# EAGLE design NeatoLDS Breakout Board_v0.1 (EAGLE 6.5.0)
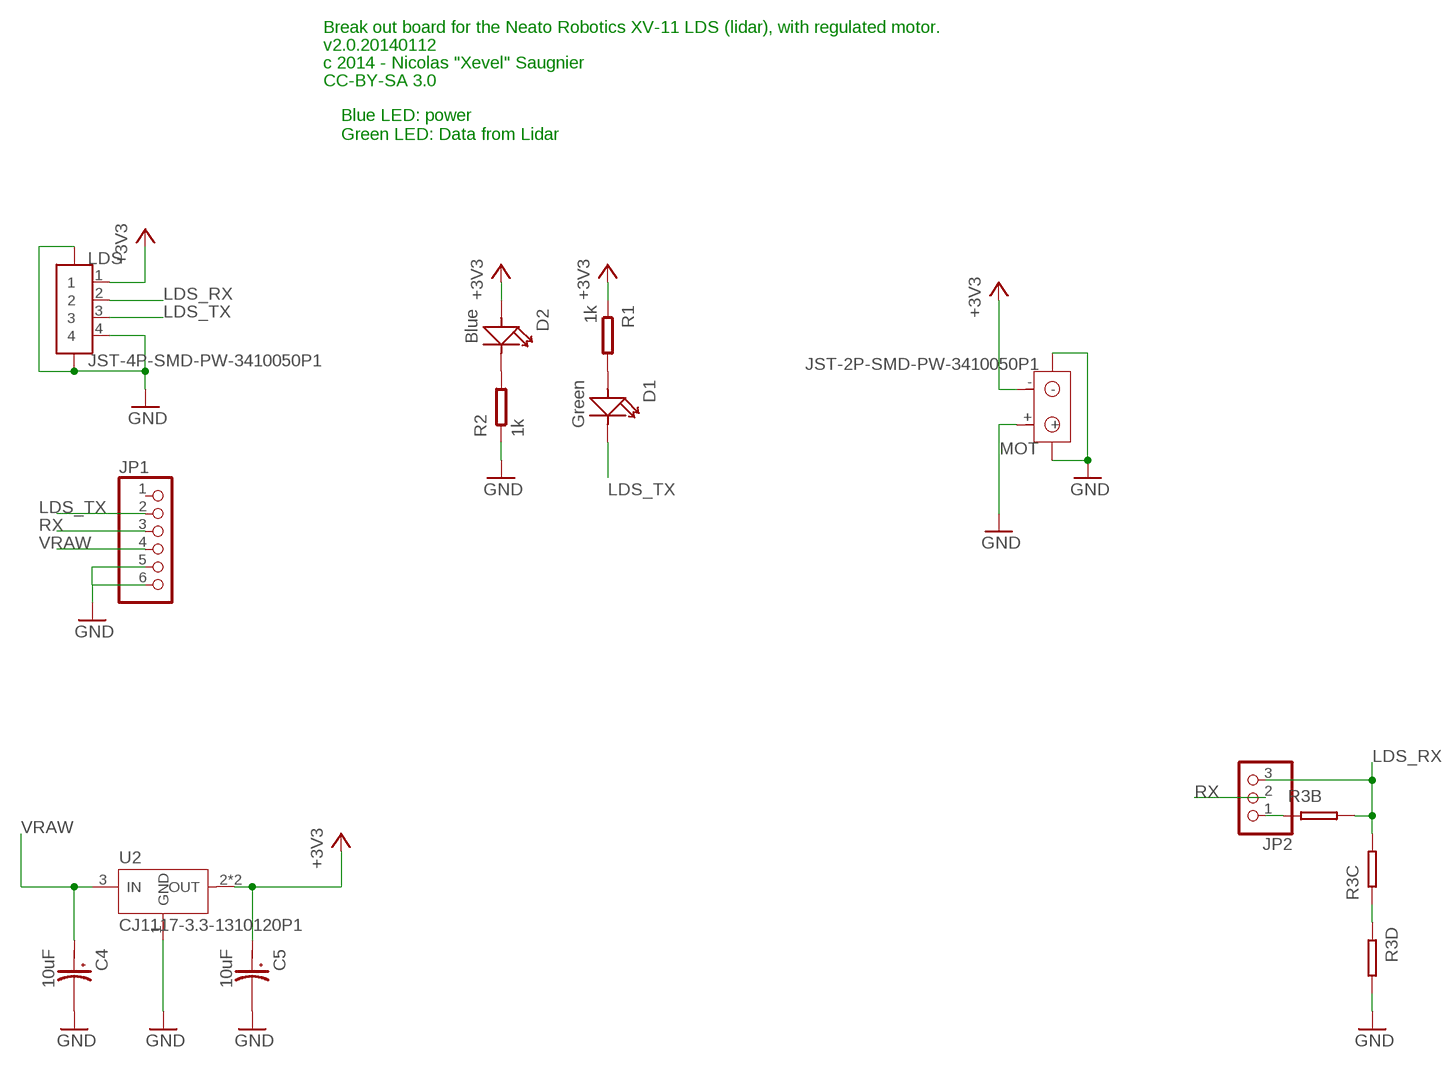
[diagram p0: schematic, sheet 1]

## Parts
C4  10uF  C-POLAR-A  [AVX-A]
C5  10uF  C-POLAR-A  [AVX-A]
D1  Green  LED  [LED0603]
D2  Blue  LED  [LED0603]
JP1  PINHD-1X6  [1X06]
JP2  PINHD-1X3  [1X03]
LDS  JST-4P-SMD-PW-3410050P1  [CON-4P-SMD-2.0-90D]
MOT  JST-2P-SMD-PW-3410050P1  [2P-SMD-2.0-90D]
R1  1k  R-0603  [R0603]
R2  1k  R-0603  [R0603]
R3  R-4R  [R1206-8]
U2  CJ1117-3.3-1310120P1  [SOT89]

## Nets
+3V3: C5.+ D2.+ LDS.1 MOT.- R1.1 U2.2(OUT) U2.4(OUT)
GND: C4.- C5.- JP1.5 JP1.6 LDS.4 LDS.5 LDS.6 MOT.3 MOT.4 MOT.+ R2.1 R3.5 U2.1(GND)
LDS_RX: JP2.3 LDS.2 R3.6 R3.7
LDS_TX: D1.- JP1.2 LDS.3
N$1: R3.3 R3.4
N$2: JP2.1 R3.2
N$5: D1.+ R1.2
N$7: D2.- R2.2
RX: JP1.3 JP2.2
VRAW: C4.+ JP1.4 U2.3(IN)
Unconnected: JP1.1 R3.1 R3.8

## Notes on the sheet
- Break out board for the Neato Robotics XV-11 LDS (lidar), with regulated motor.
- v2.0.20140112
- c 2014 - Nicolas "Xevel" Saugnier
- CC-BY-SA 3.0
- Blue LED: power
  Green LED: Data from Lidar

## Library data of the parts
C4 C5 = OPL:C-POLAR*
D1 D2 = OPL:LED*: LED
JP1 = pinhead:PINHD-1X6: PIN HEADER
JP2 = pinhead:PINHD-1X3: PIN HEADER
LDS = Xevelabs:JST-4P-SMD-PW
MOT = OPL:JST-2P-SMD-PW
R1 R2 = OPL:R*
R3 = OPL:R-4R*: Resistor Array
U2 = OPL:CJ1117-3.3: 1A Low Dropout Linear Regulator

## Board
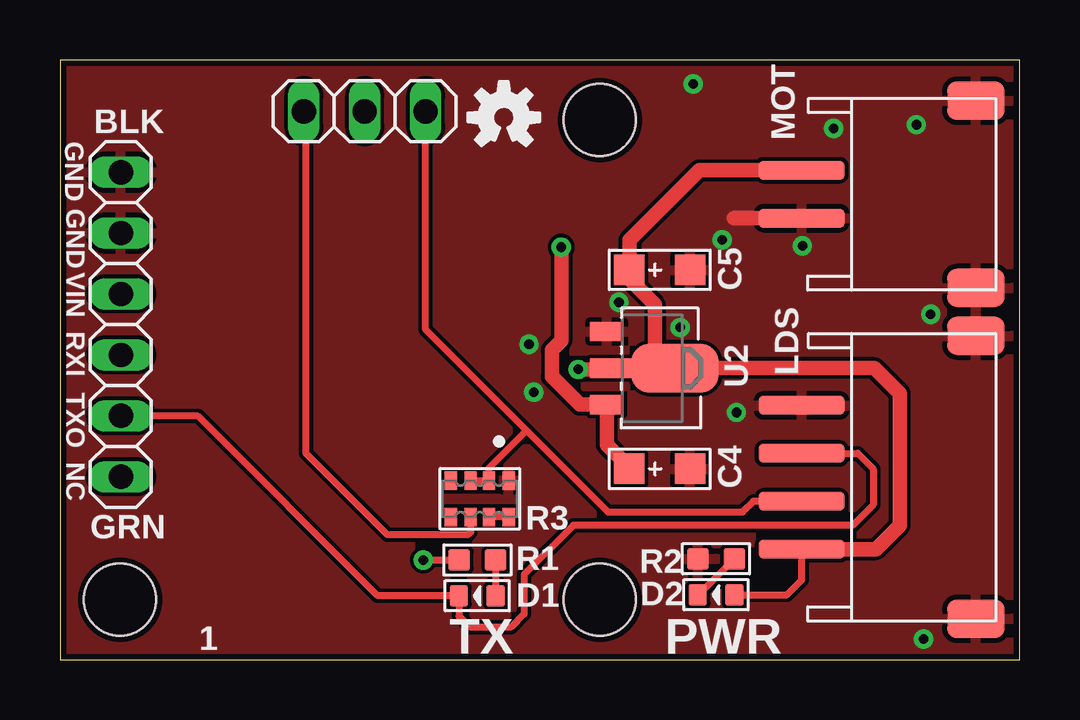
[diagram p1: board, top side]
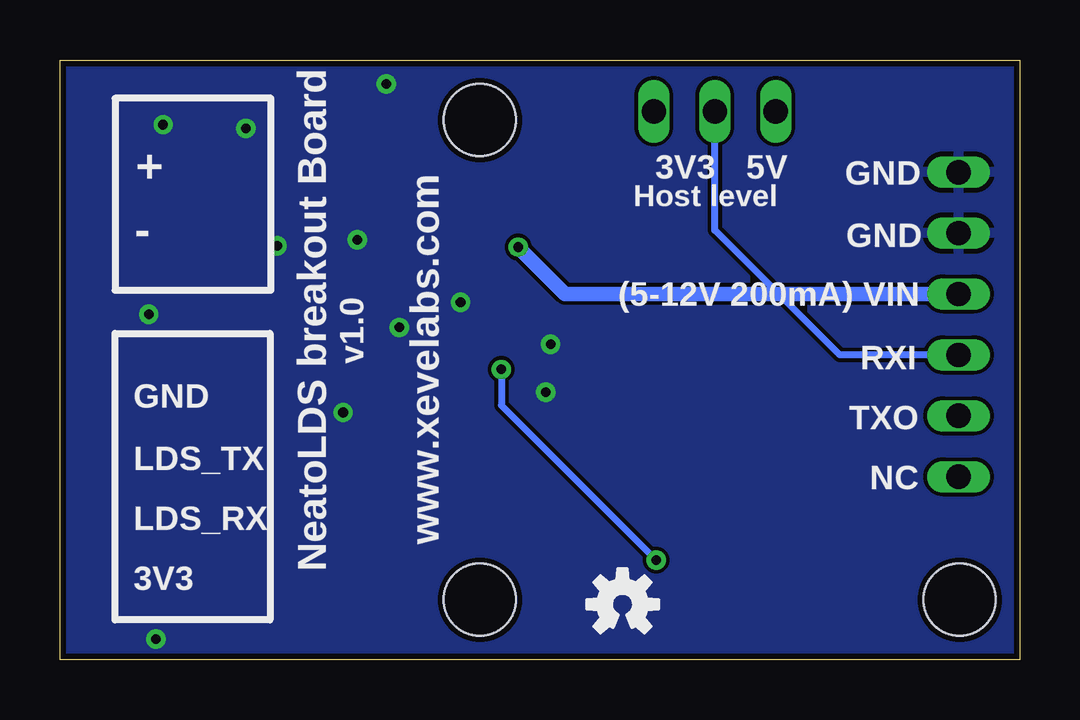
[diagram p2: board, bottom side, seen from below]

Size 40 x 25 mm. Coordinates in mm from the lower left corner, seen from the top.
Outline: 0,0 40,0 40,25 0,25 0,0
Copper layers (1*16): Top 0.035mm / dielectric 1.55mm / Bottom 0.035mm
Design rules "Xevelabs_6mil_eurocircuits": minimum track width 0.15mm, minimum drill 0.25mm, track to track 0.155mm, track to pad 0.155mm, pad to pad 0.155mm, via to via 0.155mm, smd to smd 0mil, copper to edge 0.25mm, drill to drill 0.25mm, minimum pad ring 0mil, minimum via ring 0.2mm, stop-mask expansion 0mil, vias tented up to drill 100mil, thermal gap 0.2mm
Holes 3 mm at 2.5,2.5 22.5,22.5 22.5,2.5

### Footprints (pad centres in the part's own frame; a part is rotated, then mirrored left to right if it is on the bottom)
AVX-A = smd 1.27 x 1.27: + -1.27,0; - 1.27,0
LED0603 = smd 0.762 x 0.889: + -0.762,0; - 0.762,0
1X06 = drill 1.016 long: 1 -6.35,0; 2 -3.81,0; 3 -1.27,0; 4 1.27,0; 5 3.81,0; 6 6.35,0
1X03 = drill 1.016 long: 1 -2.54,0; 2 0,0; 3 2.54,0
CON-4P-SMD-2.0-90D = smd 0.8 x 3.6: 1 -3,5.08; 2 -1,5.08; 3 1,5.08; 4 3,5.08 | smd 1.6 x 2.4: 5 -5.9,-2.181; 6 5.9,-2.181
2P-SMD-2.0-90D = smd 1.6 x 2.4: 3 3.9,-2.181; 4 -3.9,-2.181 | smd 0.8 x 3.6: + -1,5.08; - 1,5.08
R0603 = smd 0.889 x 0.889: 1 -0.762,0; 2 0.762,0
R1206-8 = smd 0.508 x 0.762: 1 -1.206,-0.762; 2 -0.381,-0.762; 3 0.381,-0.762; 4 1.206,-0.762; 5 1.206,0.762; 6 0.381,0.762; 7 -0.381,0.762; 8 -1.206,0.762
SOT89 = smd 0.8 x 1.4: 1 -1.524,-1.905; 3 1.524,-1.905 | smd 0.8 x 1.9: 2 0,-1.651 | smd 2.032 x 3.65: 4 0,0.94

### Placement (x,y rotation side)
C4  25,7.95 0 top
C5  25,16.25 0 top
D1  17.39,2.66 180 top
D2  27.35,2.7 180 top
JP1  2.54,13.97 90 top
JP2  12.7,22.86 0 top
LDS  36,7.6 90 top
MOT  36,19.4 90 top
R1  17.4,4.15 0 top
R2  27.35,4.2 0 top
R3  17.5,6.7 0 top
U2  24.7,12.15 270 top
U$1  [OSHW-LOGO-S]  18.5,22.6 0 top
U$2  [OSHW-LOGO-S]  16.55,2.3 0 bottom

### Tracks (layer width: path | path; a pad name or v marks a point on that pad's centre or on a via)
+3V3  (via drill 0.4)
  Top 0.3: D2.+ 30.3,2.7 30.92,3.32 LDS.1 | v15.15,4.15 R1.1
  Top 0.6: 24.8,12.15 U2.2 23,12.1 v21.6,12.1 | 24.8,12.15 U2.4 33.95,12.15 35,11.1 35,5.6 34,4.6 LDS.1 | 24.8,12.15 24.8,14.8 23.73,15.87 C5.+ 23.73,17.48 26.65,20.4 MOT.-
  Bottom 0.3: v21.6,12.1 21.6,10.6 v15.15,4.15
GND  (via drill 0.4)
  Top 0.6: 28.1,18.4 MOT.+
  other vias: 28.2,10.3 30.95,17.25 36.3,14.4 35.7,22.3 23.3,14.9 32.25,22.15 27.6,17.5 36,0.85 26.4,24 25.85,13.85 19.55,13.15 19.75,11.15
  pour Bottom: -0.6,25.7 42.5,25.85 43.1,-1.8 -0.7,-0.8 -0.7,25.7
  pour Top: -1.3,25.9 43.6,27.45 42.4,-1.35 -1.3,-0.6
LDS_RX
  Top 0.3: LDS.2 28.9,6.6 28.45,6.15 22.85,6.15 19.45,9.55 | R3.7 R3.6 17.88,7.98 19.45,9.55 | 19.45,9.55 15.24,13.76 JP2.3
LDS_TX
  Top 0.3: LDS.3 33.25,8.6 33.9,7.95 33.9,6.45 33.05,5.6 21.4,5.6 19.35,3.55 19.35,1.9 18.8,1.35 17.1,1.35 16.63,1.82 D1.- 13.24,2.66 5.75,10.15 JP1.2
N$1
  Top 0.3: R3.4 R3.3
N$2
  Top 0.3: R3.2 17.12,5.32 17,5.2 13.65,5.2 10.25,8.6 10.25,22.77 JP2.1
N$5
  Top 0.3: R1.2 18.16,2.67 D1.+
N$7
  Top 0.3: D2.- 26.59,2.68 R2.2
RX
  Bottom 0.3: JP1.3 7.5,12.7 12.7,17.9 JP2.2
VRAW  (via drill 0.4)
  Top 0.6: C4.+ 23.73,8.02 22.8,8.95 U2.3 21.67,10.63 20.5,11.8 20.5,12.9 20.9,13.3 v20.9,17.2
  Bottom 0.6: JP1.4 18.94,15.24 v20.9,17.2

### Text on the board
tPlace: GND | BLK | GND | VIN | RXI | TXO | NC | GRN | TX | PWR | 1
bPlace: NeatoLDS breakout Board | GND | 5V | 3V3 | + | Host level | GND | - | (5-12V 200mA) VIN | v1.0 | RXI | TXO | GND | NC | LDS_TX | www.xevelabs.com | LDS_RX | 3V3